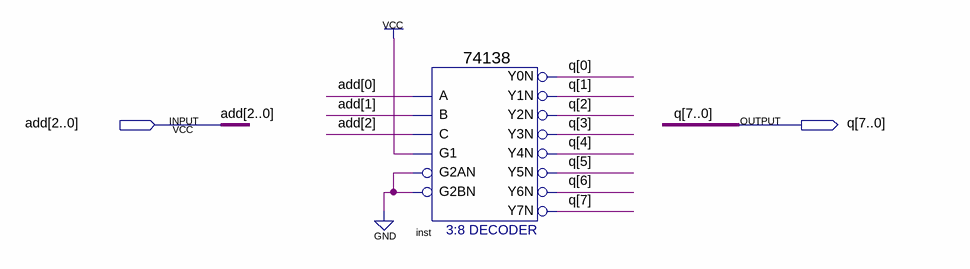
[diagram p0: schematic sheet]
// Quartus schematic dig_select.bdf as structural Verilog: 1 symbols, 2 pins
module dig_select (
  input  [2:0] add,
  output [7:0] q
);

  \74138  inst (
    .A(add[0]), .B(add[1]), .G1(1'b1), .C(add[2]), .G2AN(1'b0), .G2BN(1'b0), .Y0N(q[0]), .Y1N(q[1]),
    .Y2N(q[2]), .Y3N(q[3]), .Y4N(q[4]), .Y5N(q[5]), .Y6N(q[6]), .Y7N(q[7]));
endmodule
